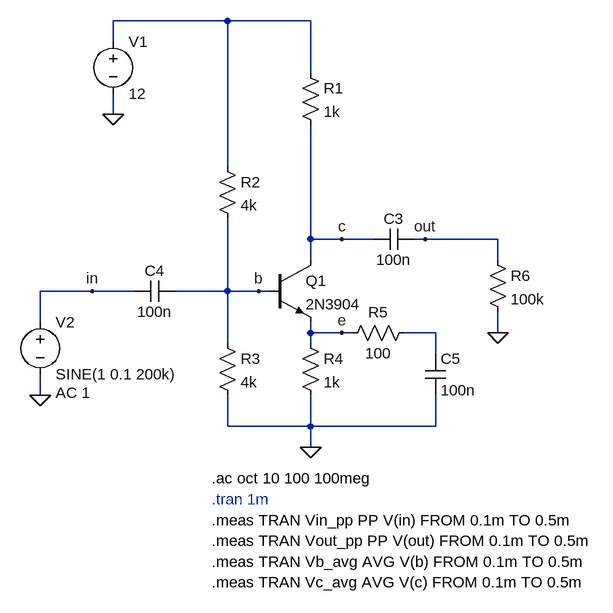
[diagram p0: schematic common_emitter_amplifier.asc]
common_emitter_amplifier.asc, the LTspice schematic file:
Version 4
SHEET 1 1412 680
WIRE 464 -400 288 -400
WIRE 592 -400 464 -400
WIRE 288 -368 288 -400
WIRE 592 -320 592 -400
WIRE 288 -256 288 -288
WIRE 464 -176 464 -400
WIRE 592 -64 592 -240
WIRE 640 -64 592 -64
WIRE 688 -64 640 -64
WIRE 768 -64 752 -64
WIRE 880 -64 768 -64
WIRE 592 -32 592 -64
WIRE 880 -32 880 -64
WIRE 256 16 176 16
WIRE 320 16 256 16
WIRE 464 16 464 -96
WIRE 464 16 384 16
WIRE 512 16 464 16
WIRE 528 16 512 16
WIRE 176 64 176 16
WIRE 592 80 592 64
WIRE 640 80 592 80
WIRE 656 80 640 80
WIRE 784 80 736 80
WIRE 880 80 880 48
WIRE 464 96 464 16
WIRE 592 96 592 80
WIRE 784 112 784 80
WIRE 176 176 176 144
WIRE 464 224 464 176
WIRE 592 224 592 176
WIRE 592 224 464 224
WIRE 784 224 784 176
WIRE 784 224 592 224
WIRE 592 256 592 224
FLAG 592 256 0
FLAG 288 -256 0
FLAG 512 16 b
FLAG 640 -64 c
FLAG 640 80 e
FLAG 256 16 in
FLAG 768 -64 out
FLAG 176 176 0
FLAG 880 80 0
SYMBOL npn 528 -32 R0
SYMATTR InstName Q1
SYMATTR Value 2N3904
SYMBOL res 576 -336 R0
SYMATTR InstName R1
SYMATTR Value 1k
SYMBOL voltage 288 -384 R0
WINDOW 123 0 0 Left 0
WINDOW 39 0 0 Left 0
SYMATTR InstName V1
SYMATTR Value 12
SYMBOL cap 752 -80 R90
WINDOW 0 0 32 VBottom 2
WINDOW 3 32 32 VTop 2
SYMATTR InstName C3
SYMATTR Value 100n
SYMBOL cap 384 0 R90
WINDOW 0 0 32 VBottom 2
WINDOW 3 32 32 VTop 2
SYMATTR InstName C4
SYMATTR Value 100n
SYMBOL res 448 -192 R0
SYMATTR InstName R2
SYMATTR Value 4k
SYMBOL res 448 80 R0
SYMATTR InstName R3
SYMATTR Value 4k
SYMBOL res 576 80 R0
SYMATTR InstName R4
SYMATTR Value 1k
SYMBOL cap 768 112 R0
SYMATTR InstName C5
SYMATTR Value 100n
SYMBOL res 752 64 R90
WINDOW 0 0 56 VBottom 2
WINDOW 3 32 56 VTop 2
SYMATTR InstName R5
SYMATTR Value 100
SYMBOL voltage 176 48 R0
WINDOW 123 24 124 Left 2
WINDOW 39 0 0 Left 0
SYMATTR InstName V2
SYMATTR Value SINE(1 0.1 200k)
SYMATTR Value2 AC 1
SYMBOL res 864 -48 R0
SYMATTR InstName R6
SYMATTR Value 100k
TEXT 440 304 Left 2 !.ac oct 10 100 100meg
TEXT 440 336 Left 2 ;.tran 1m
TEXT 440 368 Left 2 !.meas TRAN Vin_pp PP V(in) FROM 0.1m TO 0.5m
TEXT 440 400 Left 2 !.meas TRAN Vout_pp PP V(out) FROM 0.1m TO 0.5m
TEXT 440 432 Left 2 !.meas TRAN Vb_avg AVG V(b) FROM 0.1m TO 0.5m
TEXT 440 464 Left 2 !.meas TRAN Vc_avg AVG V(c) FROM 0.1m TO 0.5m

The netlist it stands for:
* common_emitter_amplifier.asc
Q1 c b e 0 2N3904
R1 N001 c 1k
V1 N001 0 12
C3 out c 100n
C4 b in 100n
R2 N001 b 4k
R3 b 0 4k
R4 e 0 1k
C5 N002 0 100n
R5 N002 e 100
V2 in 0 SINE(1 0.1 200k) AC 1
R6 out 0 100k
.model NPN NPN
.model PNP PNP
.lib standard.bjt
.ac oct 10 100 100meg
* .tran 1m
.meas TRAN Vin_pp PP V(in) FROM 0.1m TO 0.5m
.meas TRAN Vout_pp PP V(out) FROM 0.1m TO 0.5m
.meas TRAN Vb_avg AVG V(b) FROM 0.1m TO 0.5m
.meas TRAN Vc_avg AVG V(c) FROM 0.1m TO 0.5m
.backanno
.end